# EAGLE design tec_controller_v3 (EAGLE 7.2.0)
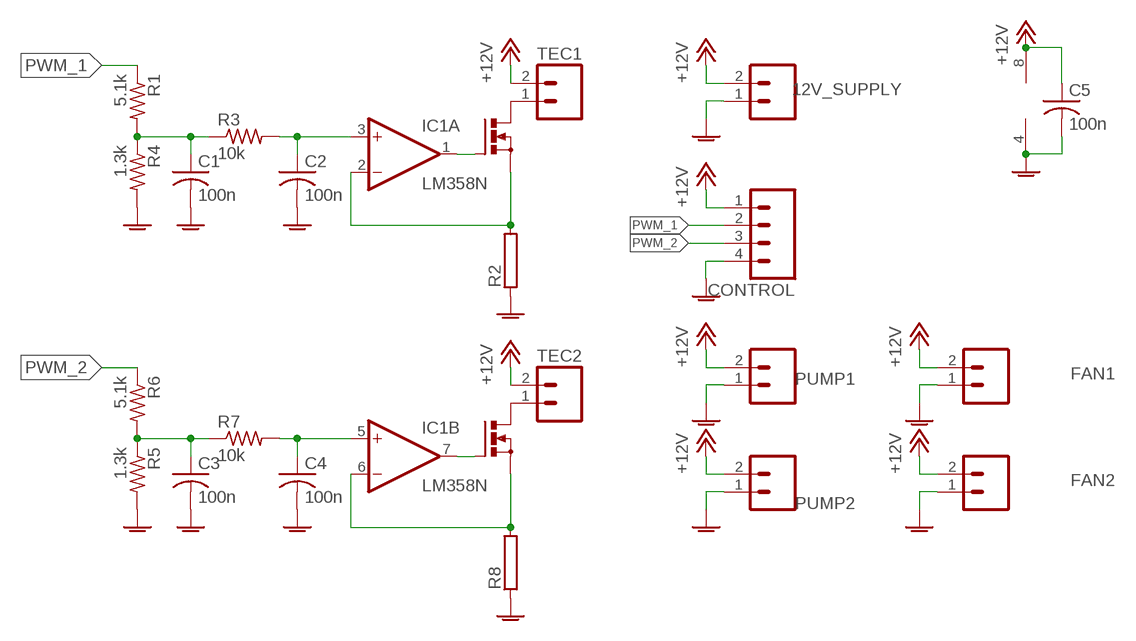
[diagram p0: schematic, sheet 1]

## Parts
12V_SUPPLY  M02LOCK_LONGPADS  [1X02_LOCK_LONGPADS]
C1  100n  C-USC0805  [C0805]
C2  100n  C-USC0805  [C0805]
C3  100n  C-USC0805  [C0805]
C4  100n  C-USC0805  [C0805]
C5  100n  C-USC0805  [C0805]
CONTROL  M04POLAR  [MOLEX-1X4]
FAN1  M02LOCK_LONGPADS  [1X02_LOCK_LONGPADS]
FAN2  M02LOCK_LONGPADS  [1X02_LOCK_LONGPADS]
IC1  LM358N  [DIL08]
PUMP1  M02LOCK_LONGPADS  [1X02_LOCK_LONGPADS]
PUMP2  M02LOCK_LONGPADS  [1X02_LOCK_LONGPADS]
Q1  IRF512  [TO220BV]
Q2  IRF512  [TO220BV]
R1  5.1k  R-US_M0805  [M0805]
R2  RAC10  [AC10]
R3  10k  R-US_M0805  [M0805]
R4  1.3k  R-US_M0805  [M0805]
R5  1.3k  R-US_M0805  [M0805]
R6  5.1k  R-US_M0805  [M0805]
R7  10k  R-US_M0805  [M0805]
R8  RAC10  [AC10]
TEC1  M02LOCK_LONGPADS  [1X02_LOCK_LONGPADS]
TEC2  M02LOCK_LONGPADS  [1X02_LOCK_LONGPADS]

## Nets
+12V: 12V_SUPPLY.2 C5.1 CONTROL.1 FAN1.2 FAN2.2 IC1.8(P:V+) PUMP1.2 PUMP2.2 TEC1.2 TEC2.2
GNDA: 12V_SUPPLY.1 C1.2 C2.2 C3.2 C4.2 C5.2 CONTROL.4 FAN1.1 FAN2.1 IC1.4(P:V-) PUMP1.1 PUMP2.1 R2.1 R4.2 R5.2 R8.1
N$1: Q1.D TEC1.1
N$3: IC1.1(A:OUT) Q1.G
N$4: C1.1 R1.2 R3.1 R4.1
N$5: C2.1 IC1.3(A:+IN) R3.2
N$6: IC1.2(A:-IN) Q1.S R2.2
N$7: C3.1 R5.1 R6.2 R7.1
N$8: C4.1 IC1.5(B:+IN) R7.2
N$9: Q2.D TEC2.1
N$11: IC1.7(B:OUT) Q2.G
N$12: IC1.6(B:-IN) Q2.S R8.2
PWM_1: CONTROL.2 R1.1
PWM_2: CONTROL.3 R6.1

## Library data of the parts
12V_SUPPLY FAN1 FAN2 PUMP1 PUMP2 TEC1 TEC2 = SparkFun-Connectors:M02: Standard 2-pin 0.1" header. Use with - straight break away headers ( PRT-00116) - right angle break away headers (PRT-00553) - swiss pins (PRT-00743) - machine pins (PRT-00117) - female headers (PRT-00115) Molex polarized connector foot print use with: PRT-08233 with associated crimp pins and housings. 2.54_SCREWTERM for use with PRT-10571. 3.5mm Screw Terminal footprints for PRT-08084 5mm Screw Terminal footprints for use with PRT-08433
C1-C5 = rcl:C-US: CAPACITOR, American symbol
CONTROL = SparkFun-Connectors:M04: Header 4 Standard 4-pin 0.1" header. Use with straight break away headers (SKU : PRT-00116), right angle break away headers (PRT-00553), swiss pins (PRT-00743), machine pins (PRT-00117), and female headers (PRT-00115). Molex polarized connector foot print use with SKU : PRT-08231 with associated crimp pins and housings. 1MM SMD Version SKU: PRT-10208
IC1 = linear:LM358: OP AMP also LM158; LM258; LM2904 Source: http://cache.national.com/ds/LM/LM158.pdf
Q1 Q2 = transistor-power:IRF512: N-CHANNEL MOS FET
R1 R3-R7 = rcl:R-US_: RESISTOR, American symbol
R2 R8 = resistor-power:R: Power Resitor; OC_FARNELL: unknown; OC_NEWARK: unknown

## Board
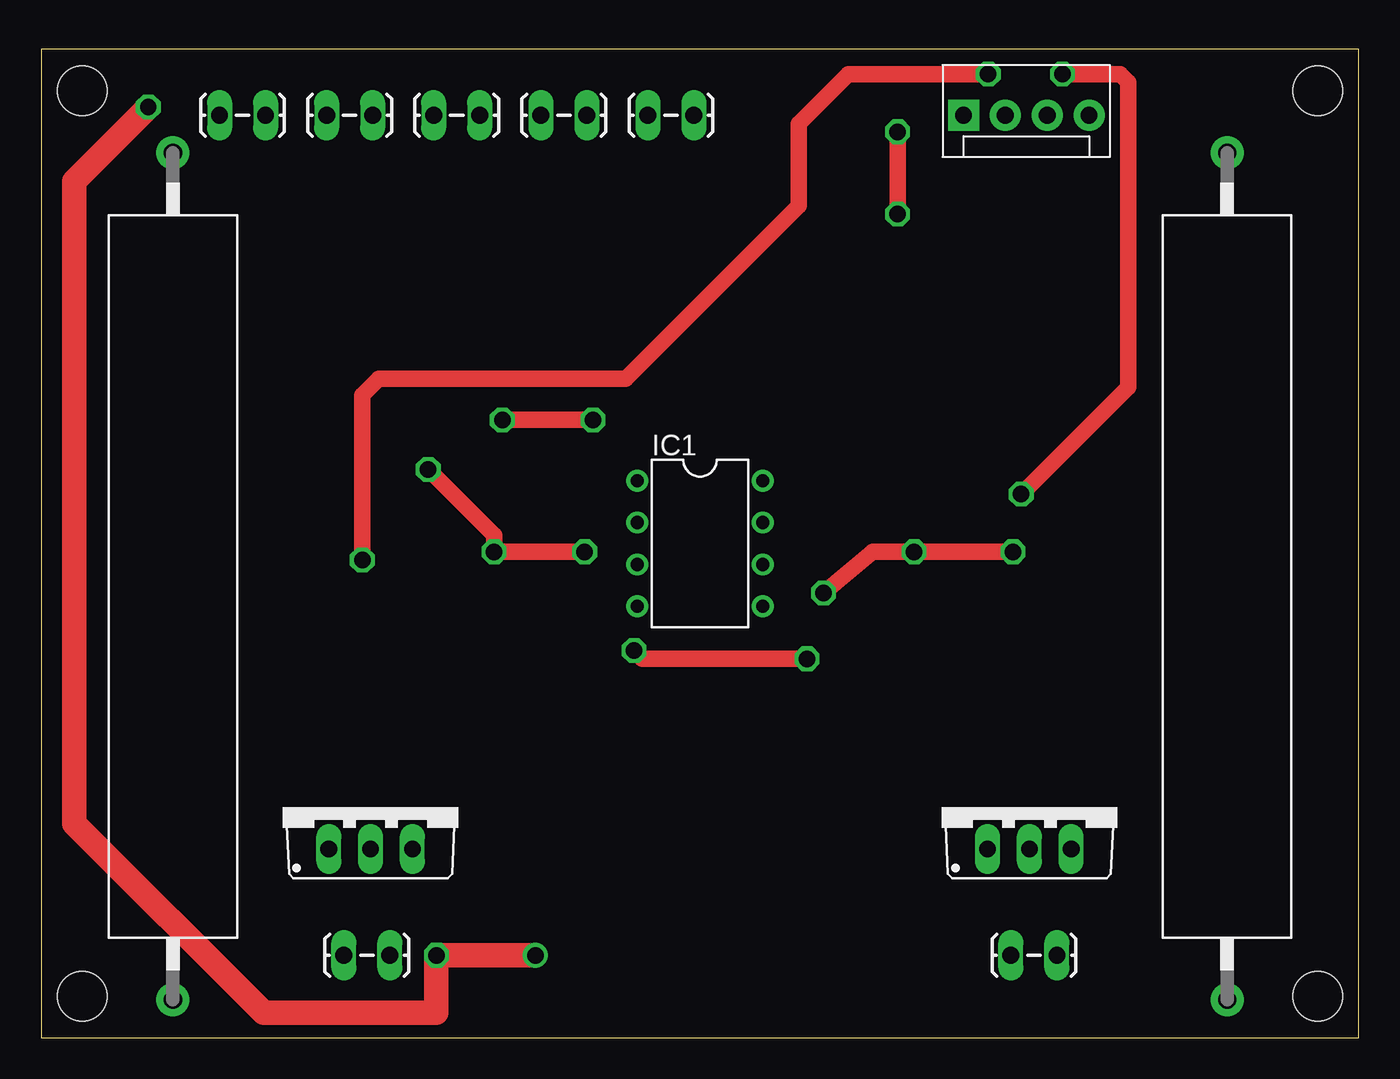
[diagram p1: board, top side]
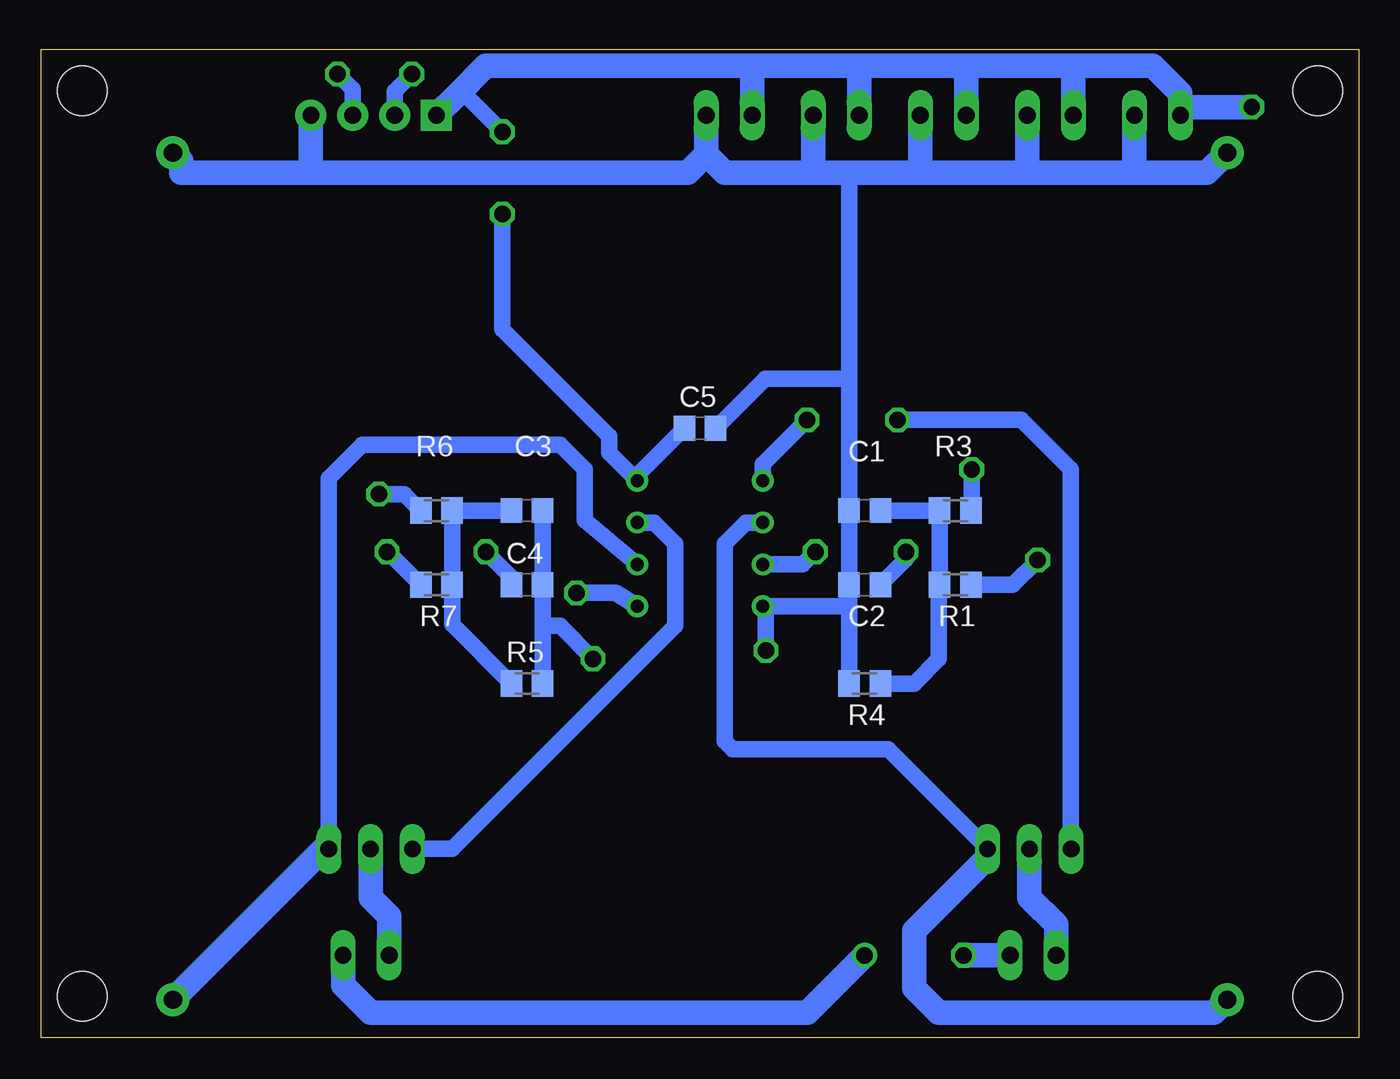
[diagram p2: board, bottom side, seen from below]

Size 80 x 60 mm. Coordinates in mm from the lower left corner, seen from the top.
Outline: 0,0 80,0 80,60 0,60 0,0
Copper layers (1*16): Top 0.035mm / dielectric 1.5mm / Bottom 0.035mm
Design rules "default *": minimum track width 10mil, minimum drill 24mil, track to track 20mil, track to pad 20mil, pad to pad 20mil, via to via 20mil, smd to smd 20mil, copper to edge 1mil, drill to drill 8mil, minimum pad ring 10mil, minimum via ring 8mil, stop-mask expansion 4mil, vias tented up to drill 0mil, thermal gap 10mil
Holes 3 mm at 2.5,57.5 77.5,57.5 77.5,2.5 2.5,2.5

### Footprints (pad centres in the part's own frame; a part is rotated, then mirrored left to right if it is on the bottom)
1X02_LOCK_LONGPADS = drill 1.016 long: 1 -0.127,0; 2 2.667,0
C0805 = smd 1.3 x 1.5: 1 -0.95,0; 2 0.95,0
MOLEX-1X4 = drill 1.016 pad 1.88 square: 1 0,0 | drill 1.016 pad 1.88: 2 2.54,0; 3 5.08,0; 4 7.62,0
DIL08 = drill 0.813 pad 1.27: 1 -3.81,-3.81; 2 -1.27,-3.81; 3 1.27,-3.81; 4 3.81,-3.81; 5 3.81,3.81; 6 1.27,3.81; 7 -1.27,3.81; 8 -3.81,3.81
TO220BV = drill 1.016 long: D 0,-2.54; G -2.54,-2.54; S 2.54,-2.54
M0805 = smd 1.3 x 1.6: 1 -0.95,0; 2 0.95,0
AC10 = drill 1.1 pad 2: 1 -25.725,0; 2 25.7,0

### Placement (x,y rotation side)
12V_SUPPLY  13.5,56 180 top
C1  30,32 180 bottom
C2  30,27.5 180 bottom
C3  50.5,32 0 bottom
C4  50.5,27.5 0 bottom
C5  40,37 0 bottom
CONTROL  56,56 0 top
FAN1  33,56 180 top
FAN2  20,56 180 top
IC1  40,30 270 top
PUMP1  39.5,56 180 top
PUMP2  26.5,56 180 top
Q1  20,14 0 top
Q2  60,14 0 top
R1  24.5,27.5 180 bottom
R2  8,28 270 top
R3  24.5,32 0 bottom
R4  30,21.5 180 bottom
R5  50.5,21.5 0 bottom
R6  56,32 0 bottom
R7  56,27.5 180 bottom
R8  72,28 270 top
TEC1  18.5,5 0 top
TEC2  59,5 0 top

### Tracks (layer width: path | path; a pad name or v marks a point on that pad's centre or on a via)
+12V  (via drill 1 pad 0.75)
  Top 1: v52,50 v52,55
  Top 1.5: v6.5,56.5 2,52 2,13 13.5,1.5 24,1.5 v24,5 v30,5
  Bottom 1: v52,50 52,43 45.5,36.5 45.5,35.5 IC1.8 43.81,34.14 C5.1 | v52,55 54.25,57.25 54.75,57.25
  Bottom 1.5: 12V_SUPPLY.2 10.83,56.5 | 10.83,56.5 10.83,57.33 12.5,59 17,59 | 17,59 23.5,59 | 23.5,59 30,59 | 30,59 36.5,59 | FAN2.2 17.33,58.67 17,59 | PUMP2.2 23.83,58.67 23.5,59 | FAN1.2 30.33,58.67 30,59 | PUMP1.2 36.83,58.67 36.5,59 | 36.5,59 53,59 54.75,57.25 CONTROL.1 | TEC1.2 v24,5 | v6.5,56.5 10.83,56.5 | TEC2.2 61.67,3.17 60,1.5 33.5,1.5 v30,5
GNDA  (via drill 1 pad 0.75)
  Top 1: v36,23.5 36.5,23 v46.5,23
  Bottom 1: R4.2 30.95,26.19 | 30.95,26.19 C2.2 C1.2 30.95,40 | 30.95,26.19 IC1.4 36,26 v36,23.5 | 49.55,25 C4.2 C3.2 | 49.55,25 R5.2 | 30.95,40 30.95,52.45 31,52.5 | v46.5,23 48.5,25 49.55,25 | C5.2 36.05,40 30.95,40
  Bottom 1.5: 13.5,52.5 20,52.5 | 20,52.5 26.5,52.5 | 26.5,52.5 31,52.5 33.5,52.5 | 33.5,52.5 38.5,52.5 39.63,53.63 | 39.63,53.63 PUMP1.1 | FAN1.1 33.13,52.87 33.5,52.5 | PUMP2.1 26.63,52.63 26.5,52.5 | FAN2.1 20.13,52.63 20,52.5 | 12V_SUPPLY.1 13.63,52.63 13.5,52.5 | 63.5,52.5 71.5,52.5 71.5,53.23 R8.1 | 63.5,52.5 40.75,52.5 39.63,53.63 | CONTROL.4 63.62,52.62 63.5,52.5 | R2.1 9.22,52.5 13.5,52.5
N$1
  Bottom 1.5: TEC1.1 18.37,6.87 20,8.5 Q1.D
N$3  (via drill 1 pad 0.75)
  Top 1: v28,37.5 v33.5,37.5
  Bottom 1: Q1.G 17.5,11.5 17.5,34.5 20.5,37.5 v28,37.5 | v33.5,37.5 36.19,34.81 IC1.1
N$4
  Bottom 1: R4.1 27,21.5 25.5,23 25.5,27.5 R1.2 R3.1 C1.1
N$5  (via drill 1 pad 0.75)
  Top 1: v23.5,34.5 27.5,30.5 v27.5,29.5 v33,29.5
  Bottom 1: C2.1 27.5,29.05 v27.5,29.5 | v23.5,34.5 23.5,32.05 R3.2 | IC1.3 33.77,28.73 v33,29.5
N$6
  Bottom 1: Q1.S 28.58,17.5 38,17.5 38.5,18 38.5,30 37.23,31.27 IC1.2
  Bottom 1.5: R2.2 8.8,1.5 25.5,1.5 27,3 27,6.5 22.54,10.96 Q1.S
N$7
  Bottom 1: C3.1 R6.2 R7.1 55.05,25.1 R5.1
N$8  (via drill 1 pad 0.75)
  Top 1: v59,29.5 v53,29.5 50.5,29.5 v47.5,27
  Bottom 1: C4.1 51.45,27.95 v53,29.5 | v59,29.5 58.95,29.5 R7.2 | IC1.5 45.12,27 v47.5,27
N$9
  Bottom 1.5: TEC2.1 58.87,7.37 60,8.5 Q2.D
N$11
  Bottom 1: Q2.G 55.04,11.46 41.5,25 41.5,30 42.77,31.27 IC1.7
N$12
  Bottom 1: Q2.S 62.54,33.96 60.5,36 48.5,36 47,34.5 47,31.42 IC1.6
  Bottom 1.5: R8.2 62.84,11.46 Q2.S
PWM_1  (via drill 1 pad 0.75)
  Top 1: v57.5,58.5 49,58.5 46,55.5 46,50.5 35.5,40 20.5,40 19.5,39 v19.5,29
  Bottom 1: CONTROL.2 58.54,57.46 v57.5,58.5 | v19.5,29 21,27.5 R1.1
PWM_2  (via drill 1 pad 0.75)
  Top 1: v62,58.5 65.5,58.5 66,58 66,39.5 v59.5,33
  Bottom 1: CONTROL.3 61.08,57.58 v62,58.5 | R6.1 57.95,33 v59.5,33